# EAGLE design btm_adapter (EAGLE 5.10)
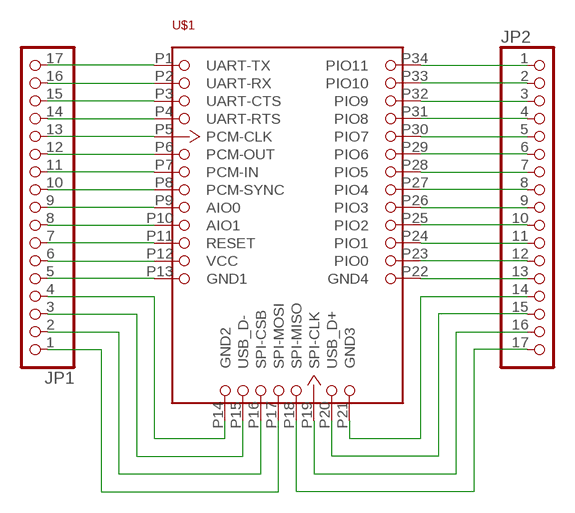
[diagram p0: schematic, sheet 1]

## Parts
JP1  PINHD-1X17  [1X17]
JP2  PINHD-1X17  [1X17]
U$1  GP-GC021  [GP-GC021]

## Nets
N$1: JP1.17 U$1.P1(UART-TX)
N$2: JP1.16 U$1.P2(UART-RX)
N$3: JP1.15 U$1.P3(UART-CTS)
N$4: JP1.14 U$1.P4(UART-RTS)
N$5: JP1.13 U$1.P5(PCM-CLK)
N$6: JP1.12 U$1.P6(PCM-OUT)
N$7: JP1.11 U$1.P7(PCM-IN)
N$8: JP1.10 U$1.P8(PCM-SYNC)
N$9: JP1.9 U$1.P9(AIO0)
N$10: JP1.8 U$1.P10(AIO1)
N$12: JP1.5 U$1.P13(GND1)
N$13: JP1.4 U$1.P14(GND2)
N$14: JP1.3 U$1.P15(USB_D-)
N$15: JP1.2 U$1.P16(SPI-CSB)
N$16: JP1.1 U$1.P17(SPI-MOSI)
N$17: JP2.1 U$1.P34(PIO11)
N$18: JP2.2 U$1.P33(PIO10)
N$19: JP2.3 U$1.P32(PIO9)
N$20: JP2.4 U$1.P31(PIO8)
N$21: JP2.5 U$1.P30(PIO7)
N$22: JP2.6 U$1.P29(PIO6)
N$23: JP2.7 U$1.P28(PIO5)
N$24: JP2.8 U$1.P27(PIO4)
N$25: JP2.9 U$1.P26(PIO3)
N$26: JP2.10 U$1.P25(PIO2)
N$27: JP2.11 U$1.P24(PIO1)
N$28: JP2.12 U$1.P23(PIO0)
N$29: JP2.13 U$1.P22(GND4)
N$30: JP2.14 U$1.P21(GND3)
N$31: JP2.15 U$1.P20(USB_D+)
N$32: JP2.16 U$1.P19(SPI-CLK)
N$33: JP2.17 U$1.P18(SPI-MISO)
N$34: JP1.7 U$1.P11(RESET)
VCC: JP1.6 U$1.P12(VCC)

## Library data of the parts
JP1 JP2 = pinhead:PINHD-1X17: PIN HEADER
U$1 = custom:GP-GC021: GP-GC021 is a Class 2 Bluetooth module using BlueCore4-AudioROM chipset from leading Bluetooth chipset supplier Cambridge Silicon Radio. GL-6B interfaces up to 8Mbit of 16-bit external Flash memory. When used with the CSR Bluetooth software stack, it provides a Bluetooth specification V2.0+EDR fully compliant system for data and voice communications.

## Board
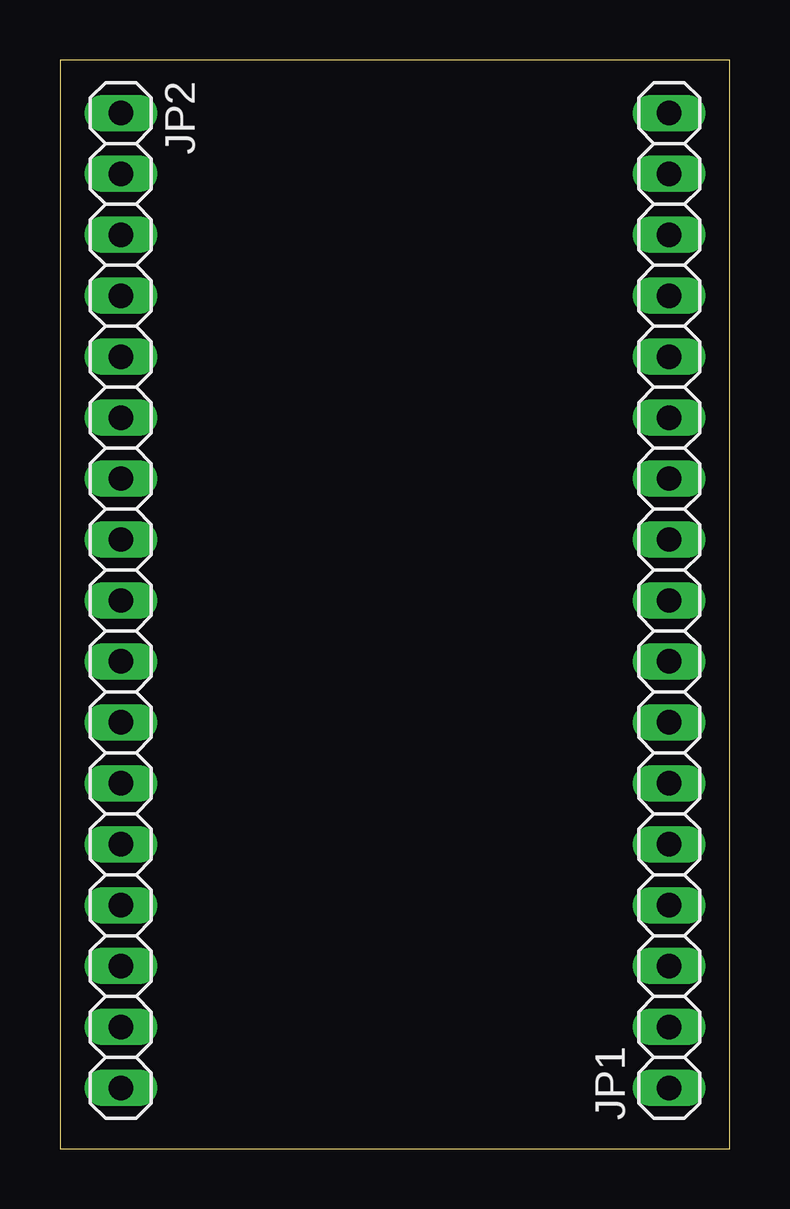
[diagram p1: board, top side]
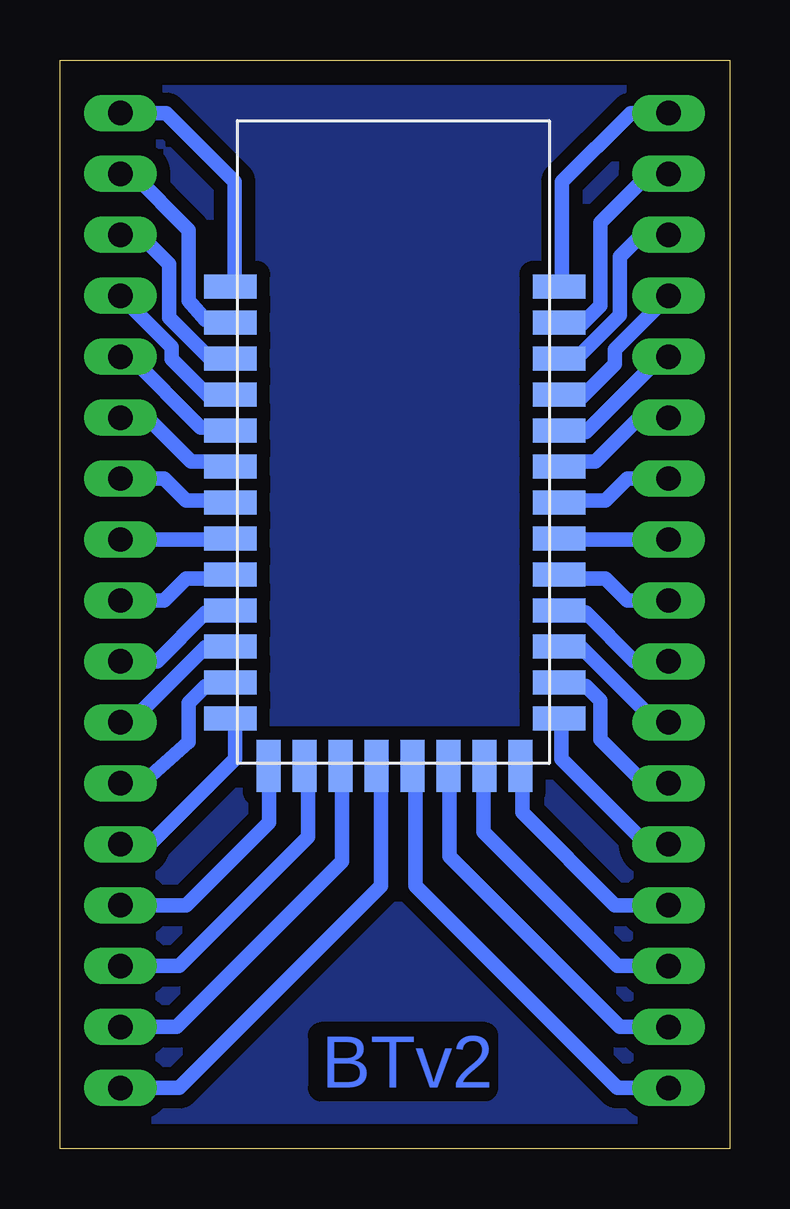
[diagram p2: board, bottom side, seen from below]

Size 27.92 x 45.39 mm. Coordinates in mm from the lower left corner, seen from the top.
Outline: 0,0 27.92,0 27.92,45.39 0,45.39 0,0
Copper layers (1*16): Top 0.035mm / dielectric 1.5mm / Bottom 0.035mm
Design rules "default *": minimum track width 10mil, minimum drill 24mil, track to track 22mil, track to pad 22mil, pad to pad 8mil, via to via 8mil, smd to smd 8mil, copper to edge 40mil, drill to drill 8mil, minimum pad ring 10mil, minimum via ring 8mil, stop-mask expansion 4mil, vias tented up to drill 0mil, thermal gap 10mil

### Footprints (pad centres in the part's own frame; a part is rotated, then mirrored left to right if it is on the bottom)
1X17 = drill 1.016 long: 1 -20.32,0; 2 -17.78,0; 3 -15.24,0; 4 -12.7,0; 5 -10.16,0; 6 -7.62,0; 7 -5.08,0; 8 -2.54,0; 9 0,0; 10 2.54,0; 11 5.08,0; 12 7.62,0; 13 10.16,0; 14 12.7,0; 15 15.24,0; 16 17.78,0; 17 20.32,0
GP-GC021 = smd 2.184 x 1: P1 -0.289,-6.909; P2 -0.289,-8.409; P3 -0.289,-9.909; P4 -0.289,-11.409; P5 -0.289,-12.909; P6 -0.289,-14.409; P7 -0.289,-15.909; P8 -0.289,-17.409; P9 -0.289,-18.909; P10 -0.289,-20.409; P11 -0.289,-21.909; P12 -0.289,-23.409; P13 -0.289,-24.909; P22 13.411,-24.909; P23 13.411,-23.409; P24 13.411,-21.909; P25 13.411,-20.409; P26 13.411,-18.909; P27 13.411,-17.409; P28 13.411,-15.909; P29 13.411,-14.409; P30 13.411,-12.909; P31 13.411,-11.409; P32 13.411,-9.909; P33 13.411,-8.409; P34 13.411,-6.909 | smd 1 x 2.184: P14 1.3,-26.9; P15 2.8,-26.9; P16 4.3,-26.9; P17 5.8,-26.9; P18 7.3,-26.9; P19 8.8,-26.9; P20 10.3,-26.9; P21 11.8,-26.9

### Placement (x,y rotation side)
JP1  25.4,22.86 90 top
JP2  2.54,22.86 270 top
U$1  20.52,42.86 0 bottom

### Tracks (layer width: path | path; a pad name or v marks a point on that pad's centre or on a via)
GND
  pour Bottom: 0,45.72 27.94,45.72 27.94,0 0,0
N$1
  Bottom 0.61: JP1.17 23.5,43.18 20.64,40.32 20.64,35.98 U$1.P1
N$2
  Bottom 0.61: JP1.16 24.89,40.64 22.55,38.3 22.55,35.36 21.84,34.54 20.7,34.54 U$1.P2
N$3
  Bottom 0.61: JP1.15 24.59,38.1 23.37,36.88 23.37,34.65 21.64,32.92 20.78,33.12 U$1.P3
N$4
  Bottom 0.61: JP1.14 23.27,33.43 23.27,32.92 21.6,31.25 U$1.P4
N$5
  Bottom 0.61: JP1.13 24.99,33.02 22.05,30.07 20.73,30.07 U$1.P5
N$6
  Bottom 0.61: JP1.12 24.28,30.48 22.45,28.65 20.81,28.65 U$1.P6
N$7
  Bottom 0.61: JP1.11 23.57,27.94 22.66,27.03 20.68,27.03 U$1.P7
N$8
  Bottom 0.61: JP1.10 20.66,25.4 U$1.P8
N$9
  Bottom 0.61: JP1.9 23.57,22.86 22.66,23.77 20.79,23.77 U$1.P9
N$10
  Bottom 0.61: JP1.8 23.88,20.32 21.84,22.35 20.91,22.35 U$1.P10
N$12
  Bottom 0.61: JP1.5 24.18,12.7 20.62,16.26 20.62,17.94 U$1.P13
N$13
  Bottom 0.61: JP1.4 22.66,10.16 19.2,13.61 19.2,15.74 U$1.P14
N$14
  Bottom 0.61: JP1.3 22.96,7.62 17.58,13.01 17.58,15.9 U$1.P15
N$15
  Bottom 0.61: JP1.2 23.06,5.08 16.15,11.99 16.15,15.83 U$1.P16
N$16
  Bottom 0.61: JP1.1 22.96,2.54 14.53,10.97 14.53,15.95 U$1.P17
N$17
  Bottom 0.61: JP2.1 4.13,43.18 6.98,40.32 6.98,36.03 U$1.P34
N$18
  Bottom 0.61: JP2.2 3.35,40.64 5.38,38.61 5.38,35.15 5.99,34.54 6.21,34.34 U$1.P33
N$19
  Bottom 0.61: JP2.3 3.66,38.1 4.57,37.19 4.57,34.75 6.4,32.92 6.87,32.92 U$1.P32
N$20
  Bottom 0.61: JP2.4 4.77,33.33 4.77,32.72 6.24,31.25 U$1.P31
N$21
  Bottom 0.61: JP2.5 2.84,33.02 5.99,29.87 6.83,29.87 U$1.P30
N$22
  Bottom 0.61: JP2.6 3.76,30.48 5.59,28.65 6.9,28.65 U$1.P29
N$23
  Bottom 0.61: JP2.7 4.27,27.94 5.18,27.03 6.83,27.03 U$1.P28
N$24
  Bottom 0.61: JP2.8 6.86,25.4 U$1.P27
N$25
  Bottom 0.61: JP2.9 4.27,22.86 5.18,23.77 6.73,23.77 U$1.P26
N$26
  Bottom 0.61: JP2.10 3.96,20.32 5.99,22.35 6.81,22.35 U$1.P25
N$27
  Bottom 0.61: JP2.11 3.05,17.78 6.2,20.93 6.88,20.93 U$1.P24
N$28
  Bottom 0.61: JP2.12 3.56,15.24 5.38,17.07 5.38,18.69 5.99,19.3 6.76,19.3 U$1.P23
N$29
  Bottom 0.61: JP2.13 3.45,12.7 7.01,16.26 7.01,17.85 U$1.P22
N$30
  Bottom 0.61: JP2.14 4.77,10.16 8.64,14.02 8.64,16.08 U$1.P21
N$31
  Bottom 0.61: JP2.15 4.67,7.62 10.26,13.21 10.26,16.12 U$1.P20
N$32
  Bottom 0.61: JP2.16 4.57,5.08 11.68,12.19 11.68,16.13 U$1.P19
N$33
  Bottom 0.61: JP2.17 4.67,2.54 13.11,10.97 13.11,15.87 U$1.P18
N$34
  Bottom 0.61: JP1.7 24.99,17.78 21.84,20.93 20.63,20.93 U$1.P11
VCC
  Bottom 0.61: JP1.6 24.49,15.24 22.55,16.97 22.55,18.59 21.84,19.3 20.87,19.3 U$1.P12

### Text on the board
Bottom: BTv2